# Altium schematic sheet Channel One.SchDoc
size A
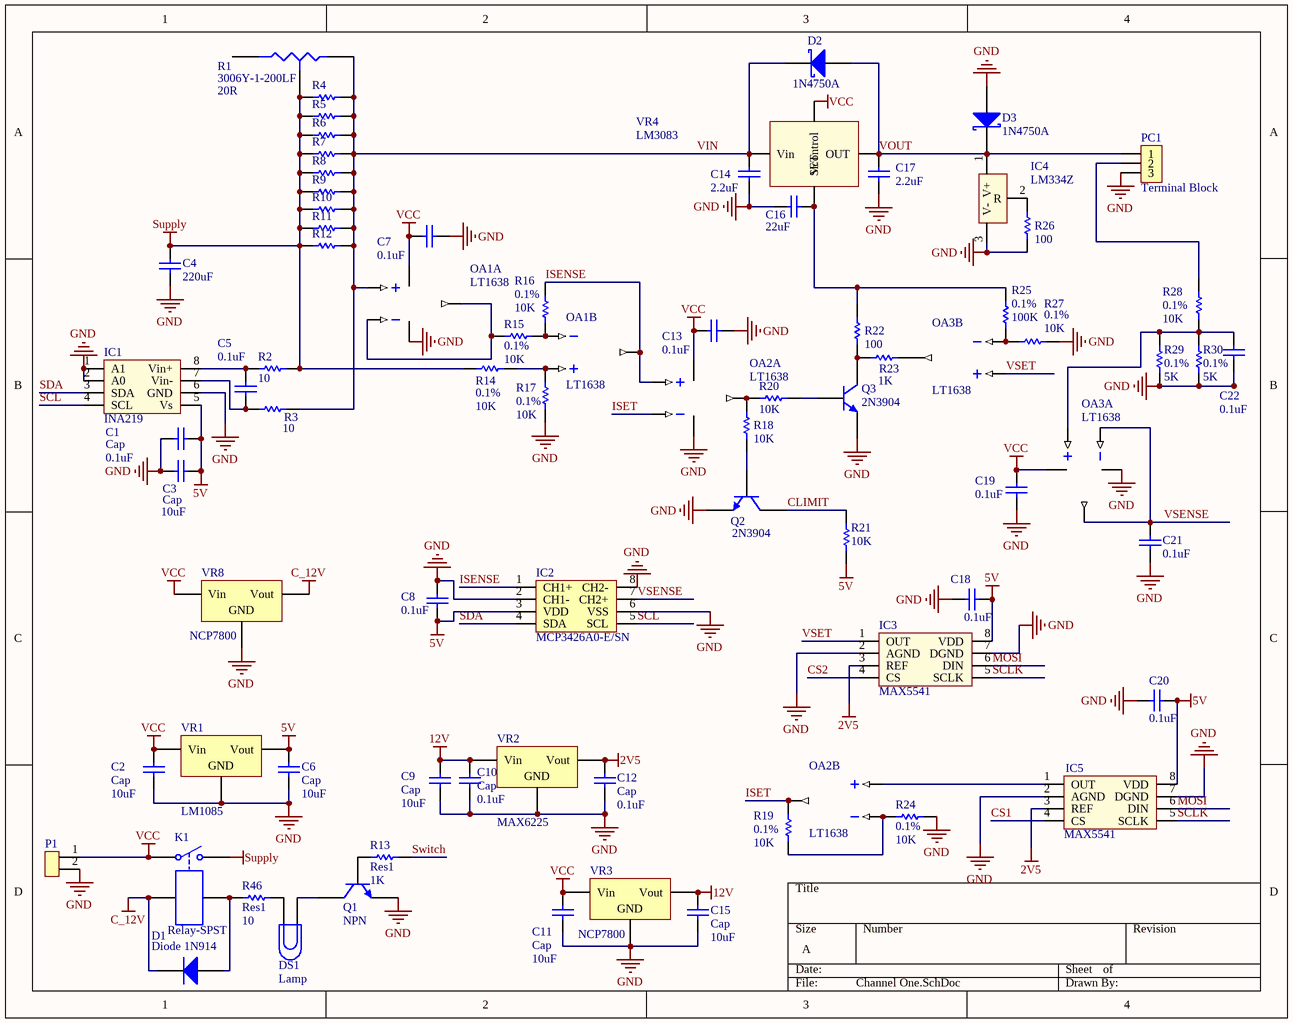
[diagram p0: Channel One.SchDoc]

## Parts
C1  Cap  value 0.1uF  [RAD-0.1]
C2  Cap  value 10uF  [RAD-0.2]
C3  Cap  value 10uF  [RAD-0.2]
C4  value 220uF  [RAD-0.2]  (hidden comment: Cap)
C5  value 0.1uF  [RAD-0.1]  (hidden comment: Cap)
C6  Cap  value 10uF  [RAD-0.2]
C7  value 0.1uF  [RAD-0.1]  (hidden comment: Cap)
C8  value 0.1uF  [RAD-0.1]  (hidden comment: Cap)
C9  Cap  value 10uF  [RAD-0.2]
C10  Cap  value 0.1uF  [RAD-0.1]
C11  Cap  value 10uF  [RAD-0.2]
C12  Cap  value 0.1uF  [RAD-0.1]
C13  value 0.1uF  [RAD-0.1]  (hidden comment: Cap)
C14  value 2.2uF  [RAD-0.1]  (hidden comment: Cap)
C15  Cap  value 10uF  [RAD-0.2]
C16  value 22uF  [RAD-0.2]  (hidden comment: Cap)
C17  value 2.2uF  [RAD-0.2]  (hidden comment: Cap)
C18  value 0.1uF  [RAD-0.1]  (hidden comment: Cap)
C19  value 0.1uF  [RAD-0.1]  (hidden comment: Cap)
C20  value 0.1uF  [RAD-0.1]  (hidden comment: Cap)
C21  value 0.1uF  [RAD-0.1]  (hidden comment: Cap)
C22  value 0.1uF  [RAD-0.1]  (hidden comment: Cap)
D1  Diode 1N914  [DO-35]
D2  1N4750A  [DO-35]
D3  1N4750A  [DO-35]
DS1  Lamp  [PIN2]
IC1  INA219  [8-SO]
IC2  MCP3426A0-E/SN  [8-SO]
IC3  MAX5541  [8-SO]
IC4  LM334Z  [LM134]
IC5  MAX5541  [8-SO]
K1  Relay-SPST  [MODULE4]
OA1  LT1638  [8-DIP]  (parts A,B of 2)
OA2  LT1638  [8-DIP]  (parts A,B of 2)
OA3  LT1638  [8-DIP]  (parts A,B of 2)
P1  Power Connector  [Power Connector]  (value not drawn)
PC1  Terminal Block  [Terminal Block 3]
Q1  NPN  [TO-226-AA]
Q2  2N3904  [TO-226-AA]
Q3  2N3904  [TO-226-AA]
R1  3006Y-1-200LF  value 20R  [VR3]
R2  value 10  [AXIAL-0.3]  (hidden comment: Res1)
R3  value 10  [AXIAL-0.3]  (hidden comment: Res1)
R4  Shunt  [AXIAL-0.3]  (value not drawn)
R5  Shunt  [AXIAL-0.3]  (value not drawn)
R6  Shunt  [AXIAL-0.3]  (value not drawn)
R7  Shunt  [AXIAL-0.3]  (value not drawn)
R8  Shunt  [AXIAL-0.3]  (value not drawn)
R9  Shunt  [AXIAL-0.3]  (value not drawn)
R10  Shunt  [AXIAL-0.3]  (value not drawn)
R11  Shunt  [AXIAL-0.3]  (value not drawn)
R12  Shunt  [AXIAL-0.3]  (value not drawn)
R13  Res1  value 1K  [AXIAL-0.3]
R14  0.1%  value 10K  [AXIAL-0.3]
R15  0.1%  value 10K  [AXIAL-0.3]
R16  0.1%  value 10K  [AXIAL-0.3]
R17  0.1%  value 10K  [AXIAL-0.3]
R18  value 10K  [AXIAL-0.3]  (hidden comment: Res)
R19  0.1%  value 10K  [AXIAL-0.3]
R20  value 10K  [AXIAL-0.3]  (hidden comment: Res)
R21  value 10K  [AXIAL-0.3]  (hidden comment: Res1)
R22  value 100  [AXIAL-0.3]  (hidden comment: Res)
R23  value 1K  [AXIAL-0.3]  (hidden comment: Res)
R24  0.1%  value 10K  [AXIAL-0.3]
R25  0.1%  value 100K  [AXIAL-0.3]
R26  value 100  [AXIAL-0.3]  (hidden comment: Res)
R27  0.1%  value 10K  [AXIAL-0.3]
R28  0.1%  value 10K  [AXIAL-0.3]
R29  0.1%  value 5K  [AXIAL-0.3]
R30  0.1%  value 5K  [AXIAL-0.3]
R46  Res1  value 10  [AXIAL-0.3]
VR1  LM1085  [TO220]
VR2  MAX6225  [8-DIP]
VR3  NCP7800  [TO220]
VR4  LM3083  [LT3083]
VR8  NCP7800  [TO220]

## Nets
2V5: C12.2 IC3.3(REF) IC5.3(REF) VR2.6(Vout)
5V: C1.2 C3.2 C6.2 C8.1 C18.2 C20.2 IC1.5(Vs) IC2.3(VDD) IC3.8(VDD) IC5.8(VDD) R21.1 VR1.3(Vout)
12V: C9.2 C10.2 C15.2 VR2.2(Vin) VR3.3(Vout)
C_12V: D1.2(K) K1.3 VR8.3(Vout)
GND: C1.1 C2.1 C3.1 C4.1 C6.1 C7.2 C8.2 C9.1 C10.1 C11.1 C12.1 C13.2 C14.1 C15.1 C16.2 C17.1 C18.1 C19.1 C20.1 C21.2 C22.2 D3.1(A) IC1.1(A1) IC1.2(A0) IC1.6(GND) IC2.2(CH1-) IC2.6(VSS) IC2.8(CH2-) IC3.2(AGND) IC3.7(DGND) IC4.3(V-) IC5.2(AGND) IC5.7(DGND) OA1.4(V-) OA2.4(V-) OA3.4(V-) P1.2 PC1.3 Q1.3(E) Q2.3(E) Q3.3(E) R17.1 R24.2 R26.2 R27.2 R29.1 R30.1 VR1.2(GND) VR2.4(GND) VR3.2(GND) VR8.2(GND)
Supply: C4.2 K1.2 R1.3(TAP) R2.1 R4.1 R5.1 R6.1 R7.1 R8.1 R9.1 R10.1 R11.1 R12.1 R14.1
VCC: C2.2 C7.1 C11.2 C13.1 C19.2 K1.1 OA1.8(V+) OA2.8(V+) OA3.8(V+) P1.1 VR1.1(Vin) VR3.1(Vin) VR4.4(Vcontrol) VR8.1(Vin)
CLIMIT: Q2.1(C) R21.2
CS1: IC5.4(CS)
CS2: IC3.4(CS)
ISENSE: IC2.1(CH1+) OA1.7(OUTB) OA2.3(+INA) R16.2
ISET: OA2.2(-INA) OA2.7(OUTB) R19.1
MOSI: IC3.6(DIN) IC5.6(DIN)
SCL: IC1.4(SCL) IC2.5(SCL)
SCLK: IC3.5(SCLK) IC5.5(SCLK)
SDA: IC1.3(SDA) IC2.4(SDA)
Switch: R13.1
VIN: C14.2 D2.2(K) OA1.3(+INA) R1.1(A) R3.2 R4.2 R5.2 R6.2 R7.2 R8.2 R9.2 R10.2 R11.2 R12.2 VR4.5(Vin)
VOUT: C17.2 D2.1(A) D3.2(K) IC4.1(V+) PC1.1 VR4.3(OUT)
VSENSE: C21.1 IC2.7(CH2+) OA3.1(OUTA) OA3.2(-INA)
VSET: IC3.1(OUT) OA3.5(+INB)
NetC5_1: C5.1 IC1.7(Vin-) R3.1
NetC5_2: C5.2 IC1.8(Vin+) R2.2
NetC16_1: C16.1 R22.1 R25.1 VR4.2(SET)
NetC22_1: C22.1 OA3.3(+INA) R28.1 R29.2 R30.2
NetD1_1: D1.1(A) K1.4 R46.2
NetDS1_1: DS1.1 Q1.1(C)
NetDS1_2: DS1.2 R46.1
NetIC4_2: IC4.2(R) R26.1
NetIC5_1: IC5.1(OUT) OA2.5(+INB)
NetOA1_1: OA1.1(OUTA) OA1.2(-INA) R15.1
NetOA1_5: OA1.5(+INB) R14.2 R17.2
NetOA1_6: OA1.6(-INB) R15.2 R16.1
NetOA2_1: OA2.1(OUTA) R18.1 R20.2
NetOA2_6: OA2.6(-INB) R19.2 R24.1
NetOA3_6: OA3.6(-INB) R25.2 R27.1
NetOA3_7: OA3.7(OUTB) R23.2
NetPC1_2: PC1.2 R28.2
NetQ1_2: Q1.2(B) R13.2
NetQ2_2: Q2.2(B) R18.2
NetQ3_1: Q3.1(C) R22.2 R23.1
NetQ3_2: Q3.2(B) R20.1

Not connected (* = marked no-connect by the designer): R1 2(B)

## Library data of the parts
C1-C22 = Cap: Capacitor; Published: 8-Jun-2000; LatestRevisionDate: 17-Jul-2002; LatestRevisionNote: Re-released for DXP Platform.; PackageReference: RAD-0.3; Publisher: Altium Limited; PackageDescription: Radial Cap, Thru-Hole; 2 Leads; 0.3 in Pin Spacing
D1 = Diode 1N914: High Conductance Fast Diode; Published: 8-Jun-2000; LatestRevisionDate: 17-Jul-2002; LatestRevisionNote: Re-released for DXP Platform.; DatasheetVersion: 1997; PackageReference: DO-35; Publisher: Altium Limited; PackageDescription: Diode, Axial; Body 3.8 x 1.9 mm (LxDia. max), Lead Dia. 0.53 mm (max); Code_JEDEC: DO-204-AH; ComponentLink1Description: Manufacturer Link; ComponentLink1URL: http://www.fairchildsemi.com/; ComponentLink2Description: Datasheet; ComponentLink2URL: http://www.fairchildsemi.com/ds/1N%2F1N4448.pdf
D2 D3 = D Schottky: Schottky Diode; Published: 8-Jun-2000; LatestRevisionDate: 17-Jul-2002; LatestRevisionNote: Re-released for DXP Platform.; PackageReference: SMB; Publisher: Altium Limited; PackageDescription: DO-214-AA/SMB; 2 C-Bend Leads; Body 5.3 x 3.6 mm, inc. leads (LxW); Code_JEDEC: DO-214-AA
DS1 = Lamp: Incandescent Bulb; Published: 24-Mar-1999; LatestRevisionDate: 17-Jul-2002; LatestRevisionNote: Re-released for DXP Platform.; PackageReference: PIN2; Publisher: Altium Limited
IC1 = Current Sense
IC2 = ADC
IC3 IC5 = DAC
IC4 = Constant Current
K1 = Relay-SPST: Single-Pole Single-Throw Relay; Published: 24-Mar-1999; LatestRevisionDate: 17-Jul-2002; LatestRevisionNote: Re-released for DXP Platform.; PackageReference: MODULE4; Publisher: Altium Limited
OA1-OA3 = Operational Amp
Q1-Q3 = NPN: NPN Bipolar Transistor; Published: 8-Jun-2000; LatestRevisionDate: 17-Jul-2002; LatestRevisionNote: Re-released for DXP Platform.; PackageReference: TO-226-AA; Publisher: Altium Limited; PackageDescription: TO, Flat Index; 3 In-Line, Axial Leads; Body Dia. 4.8mm; Leads 0.55 x 0.51 mm (max); Code_JEDEC: TO-226-AA
R1 = Res Tap: Tapped Resistor; Sim Note: Enter the Resistance value and the set point into parameter fields.; Set Position: 0.5; Published: 24-Mar-1999; LatestRevisionDate: 17-Jul-2002; LatestRevisionNote: Re-released for DXP Platform.; PackageReference: VR3; Publisher: Altium Limited; PackageDescription: Variable Resistor, Thru-Hole; 3 Leads
R2 R3 R13-R30 R46 = Res1: Resistor; Published: 8-Jun-2000; LatestRevisionDate: 17-Jul-2002; LatestRevisionNote: Re-released for DXP Platform.; PackageReference: AXIAL-0.3; Publisher: Altium Limited; PackageDescription: Axial Device, Thru-Hole; 2 Leads; 0.3 in Pin Spacing
R4-R12 = Res1: Resistor; Value: 10; Published: 8-Jun-2000; LatestRevisionDate: 17-Jul-2002; LatestRevisionNote: Re-released for DXP Platform.; PackageReference: AXIAL-0.3; Publisher: Altium Limited; PackageDescription: Axial Device, Thru-Hole; 2 Leads; 0.3 in Pin Spacing
VR1 = Voltage Regulator 5V
VR2 = Voltage Reference 2.5V
VR3 VR8 = Voltage Regulator 12V
VR4 = Adjustable Regulator